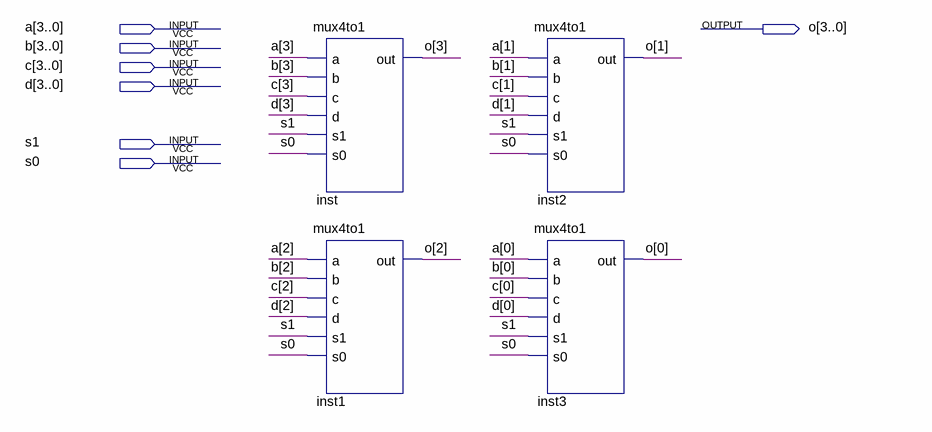
[diagram p0: schematic sheet]
// Quartus schematic mux4to1_4bits.bdf as structural Verilog: 4 symbols, 7 pins
module mux4to1_4bits (
  input  [3:0] a,
  input  [3:0] b,
  input  [3:0] c,
  input  [3:0] d,
  input  s1,
  input  s0,
  output [3:0] o
);

  mux4to1 inst (.a(a[3]), .b(b[3]), .c(c[3]), .d(d[3]), .s1(s1), .s0(s0), .out(o[3]));
  mux4to1 inst1 (.a(a[2]), .b(b[2]), .c(c[2]), .d(d[2]), .s1(s1), .s0(s0), .out(o[2]));
  mux4to1 inst2 (.a(a[1]), .b(b[1]), .c(c[1]), .d(d[1]), .s1(s1), .s0(s0), .out(o[1]));
  mux4to1 inst3 (.a(a[0]), .b(b[0]), .c(c[0]), .d(d[0]), .s1(s1), .s0(s0), .out(o[0]));
endmodule
